# Altium project Rover Power Board V0.PrjPcb
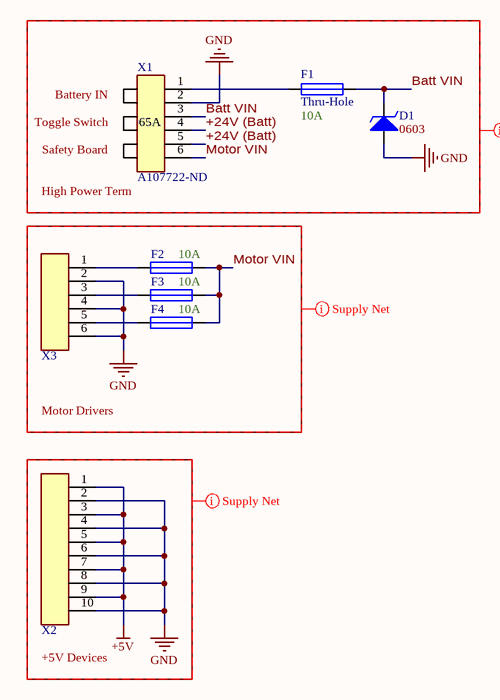
[diagram p0: Power Connections.SchDoc]
3 sheets, 50 parts. Net scope: global (net labels, ports and power ports of the same name join across sheets).
Board file: main.PcbDoc
Sheets:
  Power Connections.SchDoc
  Voltage Regulators.SchDoc
  Servo Level Shifter.SchDoc

## Sheet Power Connections.SchDoc
size A; SheetNumber: 2; SheetTotal: 4

### Parts
D1  Size Package: 0603  [[Diode] SMD 0603]  (hidden comment: TVS/Zener)
F1  Thru-Hole  Capacity: 10A  [[Fuse] Blade (2)]
F2  Capacity: 10A  [[Fuse] Blade (2)]  (hidden comment: Thru-Hole)
F3  Capacity: 10A  [[Fuse] Blade (2)]  (hidden comment: Thru-Hole)
F4  Capacity: 10A  [[Fuse] Blade (2)]  (hidden comment: Thru-Hole)
X1  Supplier Part Number 1: A107722-ND  [[Screw Terminal] 6pin 65A]  (hidden comment: [Screw Terminal] 6pin 65A)
X2  [Screw Terminal] 10pin  [[Screw Terminal] 10pin]  (value not drawn)
X3  [Screw Terminal] 6pin  [[Screw Terminal] 6pin]  (value not drawn)

### Blocks framed on the sheet
Motor Drivers: F2-F4 X3
+5V Devices: X2

### Nets
+5V: X2.1 X2.3 X2.5 X2.7 X2.9
GND: D1.2(Anode) X1.2 X2.2 X2.4 X2.6 X2.8 X2.10 X3.2 X3.4 X3.6
+24V (Batt): X1.4 X1.5
Batt VIN: D1.1(Cathode) F1.2 X1.3
Motor VIN: F2.2 F3.2 F4.2 X1.6
NetF1_1: F1.1 X1.1
NetF2_1: F2.1 X3.1
NetF3_1: F3.1 X3.3
NetF4_1: F4.1 X3.5

### Layout directives
net class Supply_Nets: +5V, +24V (Batt), Batt VIN, GND, Motor VIN

### Notes on the sheet
- Battery IN
- Toggle Switch
- (near X1) High Power Term
- Safety Board
- (in symbol [Screw Terminal] 6pin 65A) 65A

### Library data of the parts
D1 = [Diode] TVS Diode: Generic; Supplier 1: DigiKey; Supplier Part Number 1: 641-1679-1-ND
F1-F4 = [Fuse] Thru-Hole Blade: Mouser Part #: *
X1 = [Screw Terminal] 6pin 65A: Remember to order 3 of the screw term for one of these!; Supplier 1: DigiKey
X2 = [Screw Terminal] 10pin: x5; Supplier 1: DigiKey; Supplier Part Number 1: 102-6145-ND
X3 = [Screw Terminal] 6pin: x3; Supplier 1: DigiKey; Supplier Part Number 1: 102-6145-ND

## Sheet Voltage Regulators.SchDoc
size B; SheetNumber: 3; SheetTotal: 4
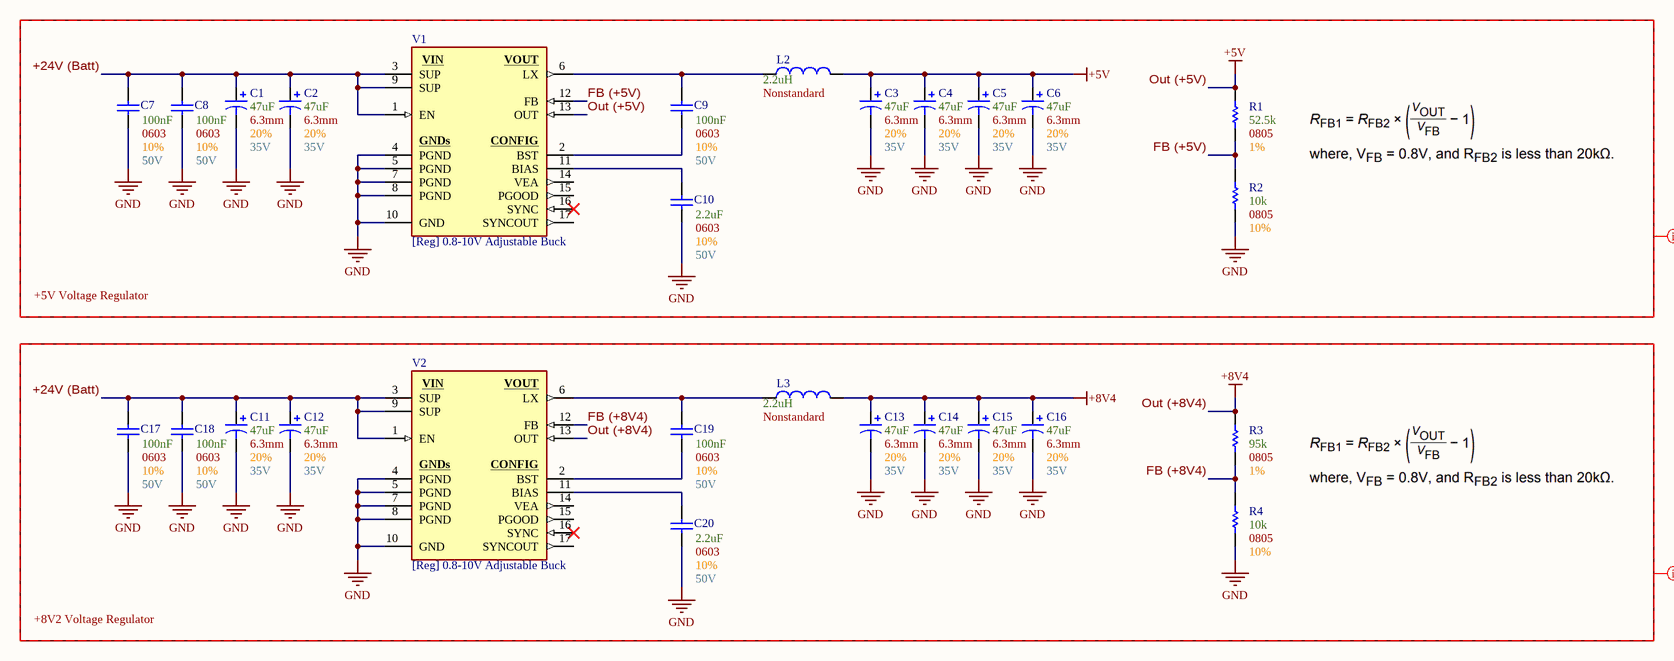
[diagram p1: Voltage Regulators.SchDoc]

### Parts
C1  Tolerance: 20%  Max Voltage: 35V  Capacitance: 47uF  Diameter: 6.3mm  [[Cap] SMD Polarized, 6.3mm]  (hidden comment: SMD Polarized)
C2  Tolerance: 20%  Max Voltage: 35V  Capacitance: 47uF  Diameter: 6.3mm  [[Cap] SMD Polarized, 6.3mm]  (hidden comment: SMD Polarized)
C3  Tolerance: 20%  Max Voltage: 35V  Capacitance: 47uF  Diameter: 6.3mm  [[Cap] SMD Polarized, 6.3mm]  (hidden comment: SMD Polarized)
C4  Tolerance: 20%  Max Voltage: 35V  Capacitance: 47uF  Diameter: 6.3mm  [[Cap] SMD Polarized, 6.3mm]  (hidden comment: SMD Polarized)
C5  Tolerance: 20%  Max Voltage: 35V  Capacitance: 47uF  Diameter: 6.3mm  [[Cap] SMD Polarized, 6.3mm]  (hidden comment: SMD Polarized)
C6  Tolerance: 20%  Max Voltage: 35V  Capacitance: 47uF  Diameter: 6.3mm  [[Cap] SMD Polarized, 6.3mm]  (hidden comment: SMD Polarized)
C7  Voltage: 50V  Tolerance: 10%  Size Package: 0603  Capacitance: 100nF  [[Cap] SMD 0603]  (hidden comment: SMD Nonpolarized)
C8  Voltage: 50V  Tolerance: 10%  Size Package: 0603  Capacitance: 100nF  [[Cap] SMD 0603]  (hidden comment: SMD Nonpolarized)
C9  Voltage: 50V  Tolerance: 10%  Size Package: 0603  Capacitance: 100nF  [[Cap] SMD 0603]  (hidden comment: SMD Nonpolarized)
C10  Voltage: 50V  Tolerance: 10%  Size Package: 0603  Capacitance: 2.2uF  [[Cap] SMD 0603]  (hidden comment: SMD Nonpolarized)
C11  Tolerance: 20%  Max Voltage: 35V  Capacitance: 47uF  Diameter: 6.3mm  [[Cap] SMD Polarized, 6.3mm]  (hidden comment: SMD Polarized)
C12  Tolerance: 20%  Max Voltage: 35V  Capacitance: 47uF  Diameter: 6.3mm  [[Cap] SMD Polarized, 6.3mm]  (hidden comment: SMD Polarized)
C13  Tolerance: 20%  Max Voltage: 35V  Capacitance: 47uF  Diameter: 6.3mm  [[Cap] SMD Polarized, 6.3mm]  (hidden comment: SMD Polarized)
C14  Tolerance: 20%  Max Voltage: 35V  Capacitance: 47uF  Diameter: 6.3mm  [[Cap] SMD Polarized, 6.3mm]  (hidden comment: SMD Polarized)
C15  Tolerance: 20%  Max Voltage: 35V  Capacitance: 47uF  Diameter: 6.3mm  [[Cap] SMD Polarized, 6.3mm]  (hidden comment: SMD Polarized)
C16  Tolerance: 20%  Max Voltage: 35V  Capacitance: 47uF  Diameter: 6.3mm  [[Cap] SMD Polarized, 6.3mm]  (hidden comment: SMD Polarized)
C17  Voltage: 50V  Tolerance: 10%  Size Package: 0603  Capacitance: 100nF  [[Cap] SMD 0603]  (hidden comment: SMD Nonpolarized)
C18  Voltage: 50V  Tolerance: 10%  Size Package: 0603  Capacitance: 100nF  [[Cap] SMD 0603]  (hidden comment: SMD Nonpolarized)
C19  Voltage: 50V  Tolerance: 10%  Size Package: 0603  Capacitance: 100nF  [[Cap] SMD 0603]  (hidden comment: SMD Nonpolarized)
C20  Voltage: 50V  Tolerance: 10%  Size Package: 0603  Capacitance: 2.2uF  [[Cap] SMD 0603]  (hidden comment: SMD Nonpolarized)
L2  Size Package: Nonstandard  Inductance: 2.2uH  [[Inductor] 7.4 X 6.6 X 3 MM]  (hidden comment: SMD Inductor)
L3  Size Package: Nonstandard  Inductance: 2.2uH  [[Inductor] 7.4 X 6.6 X 3 MM]  (hidden comment: SMD Inductor)
R1  Tolerance: 1%  Resistance: 52.5k  Size Package: 0805  [[Res] SMD 0805]  (hidden comment: [Res] SMD Resistor)
R2  Tolerance: 10%  Resistance: 10k  Size Package: 0805  [[Res] SMD 0805]  (hidden comment: [Res] SMD Resistor)
R3  Tolerance: 1%  Resistance: 95k  Size Package: 0805  [[Res] SMD 0805]  (hidden comment: [Res] SMD Resistor)
R4  Tolerance: 10%  Resistance: 10k  Size Package: 0805  [[Res] SMD 0805]  (hidden comment: [Res] SMD Resistor)
V1  [Reg] 0.8-10V Adjustable Buck  [[Reg] 0.8-10V Adjustable Buck]
V2  [Reg] 0.8-10V Adjustable Buck  [[Reg] 0.8-10V Adjustable Buck]

### Blocks framed on the sheet
+5V Voltage Regulator: C1-C10 L2 R1 R2 V1
+8V2 Voltage Regulator: C11-C20 L3 R3 R4 V2

### Nets
+5V: C3.1 C4.1 C5.1 C6.1 L2.2 R1.2 V1.13(OUT)  [also labelled Out (+5V)]
+8V4: C13.1 C14.1 C15.1 C16.1 L3.2 R3.2 V2.13(OUT)  [also labelled Out (+8V4)]
GND: C1.2 C2.2 C3.2 C4.2 C5.2 C6.2 C7.1 C8.1 C10.1 C11.2 C12.2 C13.2 C14.2 C15.2 C16.2 C17.1 C18.1 C20.1 R2.1 R4.1 V1.4(PGND) V1.5(PGND) V1.7(PGND) V1.8(PGND) V1.10(GND) V2.4(PGND) V2.5(PGND) V2.7(PGND) V2.8(PGND) V2.10(GND)
+24V (Batt): C1.1 C2.1 C7.2 C8.2 C11.1 C12.1 C17.2 C18.2 V1.1(EN) V1.3(SUP) V1.9(SUP) V2.1(EN) V2.3(SUP) V2.9(SUP)
FB (+5V): R1.1 R2.2 V1.12(FB)
FB (+8V4): R3.1 R4.2 V2.12(FB)
NetC9_1: C9.1 V1.2(BST)
NetC9_2: C9.2 L2.1 V1.6(LX)
NetC10_2: C10.2 V1.11(BIAS)
NetC19_1: C19.1 V2.2(BST)
NetC19_2: C19.2 L3.1 V2.6(LX)
NetC20_2: C20.2 V2.11(BIAS)

Not connected (* = marked no-connect by the designer): V1 14(VEA) 15(PGOOD) 16(SYNC)* 17(SYNCOUT); V2 14(VEA) 15(PGOOD) 16(SYNC)* 17(SYNCOUT)

### Layout directives
net class Supply_Nets: +5V, +8V4, +24V (Batt), FB (+5V), FB (+8V4), GND, Out (+5V), Out (+8V4)

### Notes on the sheet
- (in symbol [Reg] 0.8-10V Adjustable Buck) VIN; VOUT; GNDs; CONFIG

### Library data of the parts
C1-C6 C11-C16 = [Cap] SMD Polarized: Supplier 1: DigiKey; Supplier Part Number 1: PCE3842CT-ND
C7-C10 C17-C20 = [Cap] SMD Nonpolarized: Supplier 1: DigiKey
  C7-C9 C17-C19: Supplier Part Number 1: 1276-1003-1-ND
  C10 C20: Supplier Part Number 1: 1276-1134-1-ND
L2 L3 = [Inductor] SMD Inductor: JLC Part #: *; Mouser Part #: *; Supplier 1: DigiKey; Supplier Part Number 1: XC2402CT-ND
R1-R4 = [Res] SMD Resistor: Generic; Supplier 1: DigiKey
  R1: Supplier Part Number 1: 311-52.3KCRCT-ND
  R2 R4: Supplier Part Number 1: RR12P10.0KDCT-ND
  R3: Supplier Part Number 1: RMCF0805FT95K3DKR-ND
V1 V2 = [Reg] 0.8-10V Adjustable Buck: MAX20408AFOF/VY+; Supplier 1: DigiKey; Supplier Part Number 1: 505-MAX20408AFOF/VY+-ND

## Sheet Servo Level Shifter.SchDoc
size A; SheetNumber: 4; SheetTotal: 4
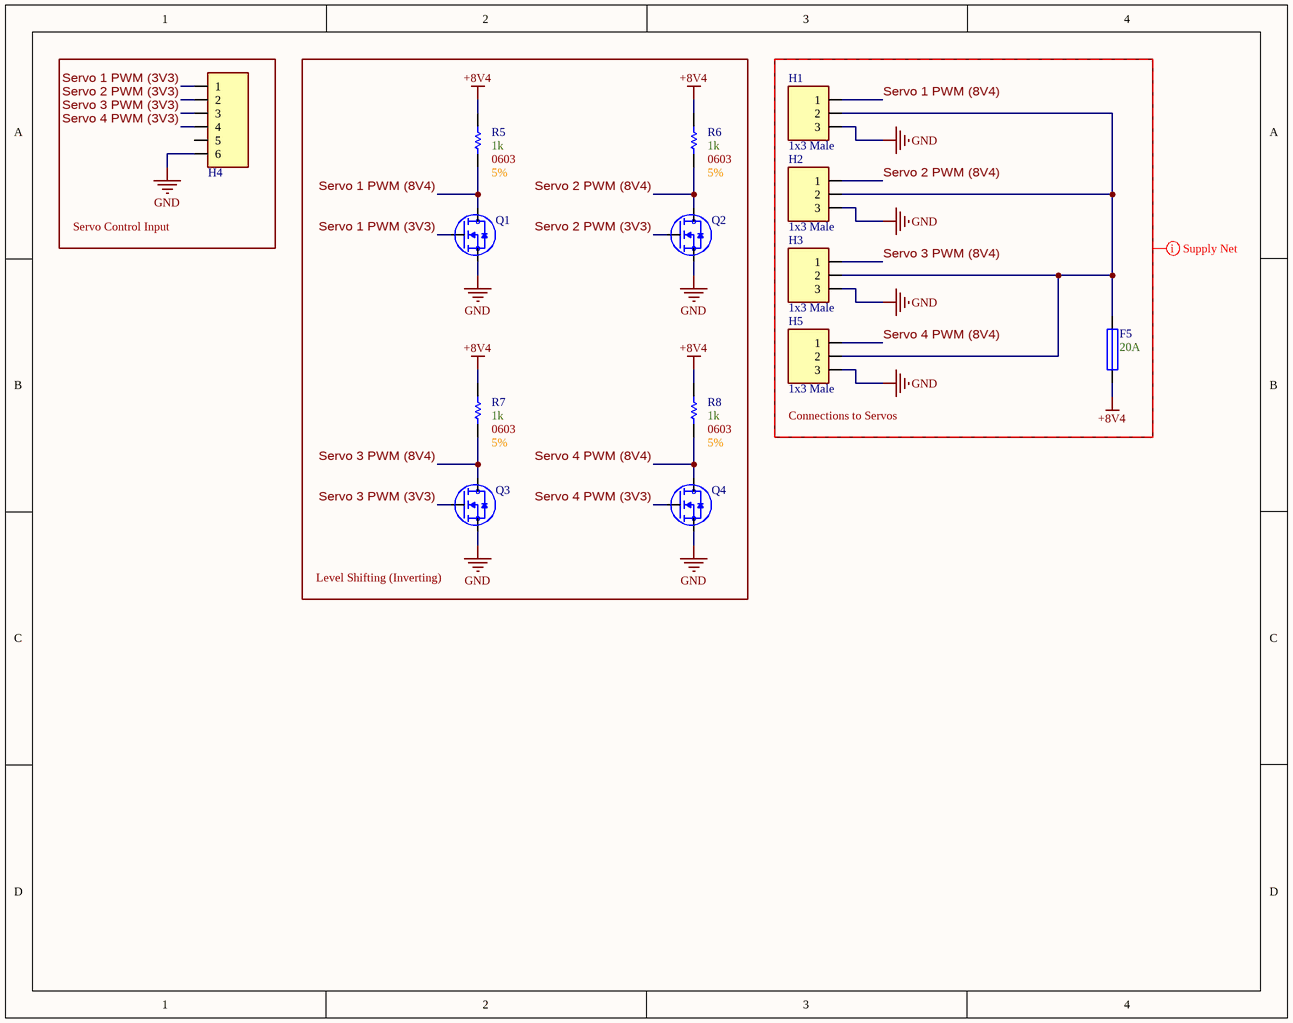
[diagram p2: Servo Level Shifter.SchDoc]

### Parts
F5  Capacity: 20A  [[Fuse] Thru-Hole Blade]  (hidden comment: Thru-Hole)
H1  1x3 Male  [[Header] Shrouded 1x3 Male]
H2  1x3 Male  [[Header] Shrouded 1x3 Male]
H3  1x3 Male  [[Header] Shrouded 1x3 Male]
H4  [Header] Shrouded 1x6 Male  [[Header] Shrouded 1x6 Male]  (value not drawn)
H5  1x3 Male  [[Header] Shrouded 1x3 Male]
Q1  DMG1012UW-7  [[FET] N-Channel Mosfet]  (value not drawn)
Q2  DMG1012UW-7  [[FET] N-Channel Mosfet]  (value not drawn)
Q3  DMG1012UW-7  [[FET] N-Channel Mosfet]  (value not drawn)
Q4  DMG1012UW-7  [[FET] N-Channel Mosfet]  (value not drawn)
R5  Tolerance: 5%  Resistance: 1k  Size Package: 0603  [[Res] SMD 0603]  (hidden comment: [Res] SMD Resistor)
R6  Tolerance: 5%  Resistance: 1k  Size Package: 0603  [[Res] SMD 0603]  (hidden comment: [Res] SMD Resistor)
R7  Tolerance: 5%  Resistance: 1k  Size Package: 0603  [[Res] SMD 0603]  (hidden comment: [Res] SMD Resistor)
R8  Tolerance: 5%  Resistance: 1k  Size Package: 0603  [[Res] SMD 0603]  (hidden comment: [Res] SMD Resistor)

### Blocks framed on the sheet
Servo Control Input: H4
Level Shifting (Inverting): Q1-Q4 R5-R8
Connections to Servos: F5 H1-H3 H5

### Nets
+8V4: F5.1 R5.2 R6.2 R7.2 R8.2
GND: H1.3 H2.3 H3.3 H4.6 H5.3 Q1.2(Source) Q2.2(Source) Q3.2(Source) Q4.2(Source)
Servo 1 PWM (3V3): H4.1 Q1.1(Gate)
Servo 1 PWM (8V4): H1.1 Q1.3(Drain) R5.1
Servo 2 PWM (3V3): H4.2 Q2.1(Gate)
Servo 2 PWM (8V4): H2.1 Q2.3(Drain) R6.1
Servo 3 PWM (3V3): H4.3 Q3.1(Gate)
Servo 3 PWM (8V4): H3.1 Q3.3(Drain) R7.1
Servo 4 PWM (3V3): H4.4 Q4.1(Gate)
Servo 4 PWM (8V4): H5.1 Q4.3(Drain) R8.1
NetF5_2: F5.2 H1.2 H2.2 H3.2 H5.2

Not connected (* = marked no-connect by the designer): H4 5

### Layout directives
net class Supply_Nets: +8V4, GND, Servo 1 PWM (8V4), Servo 2 PWM (8V4), Servo 3 PWM (8V4), Servo 4 PWM (8V4)

### Library data of the parts
F5 = [Fuse] Thru-Hole Blade: Mouser Part #: *; Supplier 1: DigiKey; Supplier Part Number 1: WK6265-ND
H1-H3 H5 = [Header] Shrouded 1x3 Male: 070543-0037 / Mates with 005057-9403; Supplier 1: DigiKey; Supplier 2: DigiKey; Supplier Part Number 1: WM4825-ND; Supplier Part Number 2: WM2901-ND
H4 = [Header] Shrouded 1x6 Male: 0705430005 / Mates with 0050579406; Supplier 1: DigiKey; Supplier 2: DigiKey; Supplier Part Number 1: WM4804-ND; Supplier Part Number 2: WM2904-ND
Q1-Q4 = [FET] N-Channel MOSFET: Supplier 1: DigiKey; Supplier Part Number 1: DMG1012UW-7DICT-ND
R5-R8 = [Res] SMD Resistor: Generic; Supplier 1: DigiKey; Supplier Part Number 1: RMCF0603FT1K00DKR-ND

## Nets that join several sheets
+5V: Power Connections (5 pins), Voltage Regulators (7 pins)
+8V4: Voltage Regulators (7 pins), Servo Level Shifter (5 pins)
GND: Power Connections (10 pins), Voltage Regulators (30 pins), Servo Level Shifter (9 pins)
+24V (Batt): Power Connections (X1.4 X1.5), Voltage Regulators (14 pins)